# EasyEDA Pro project 鲲FOC无刷电机控制器.epro, board 磁编码器板
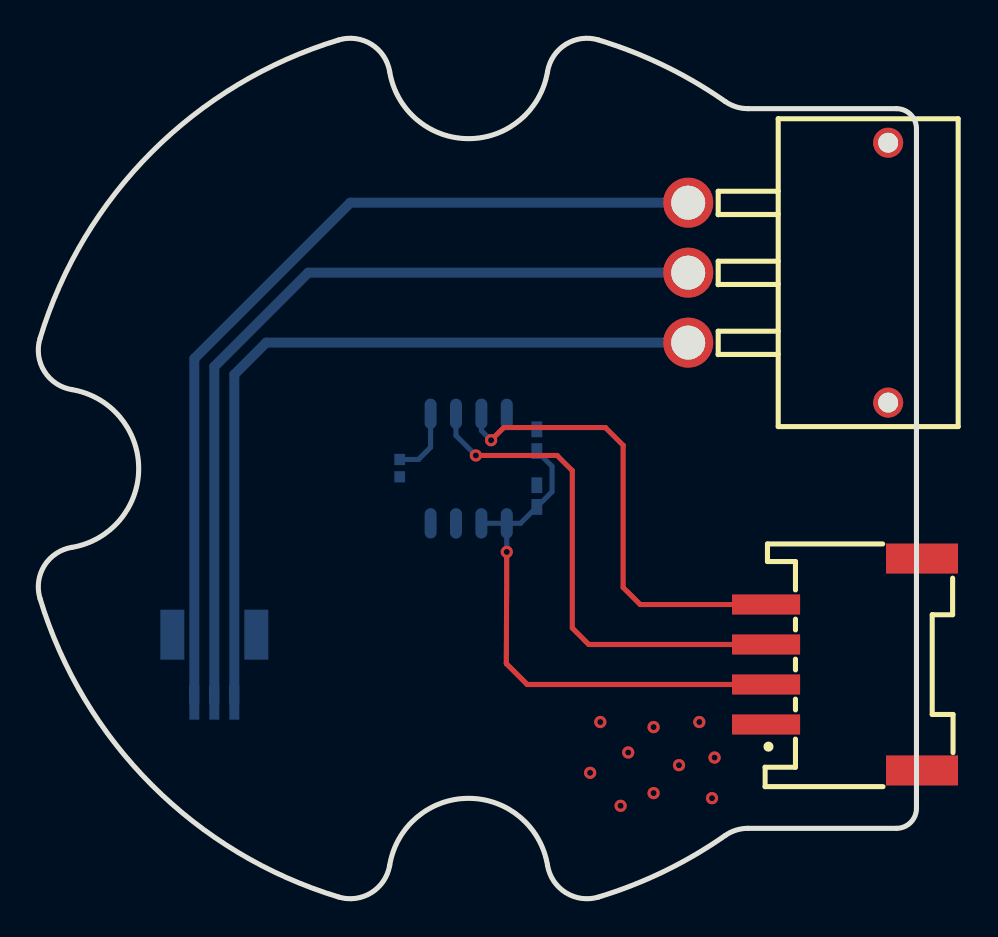
[diagram p4: board, top side]
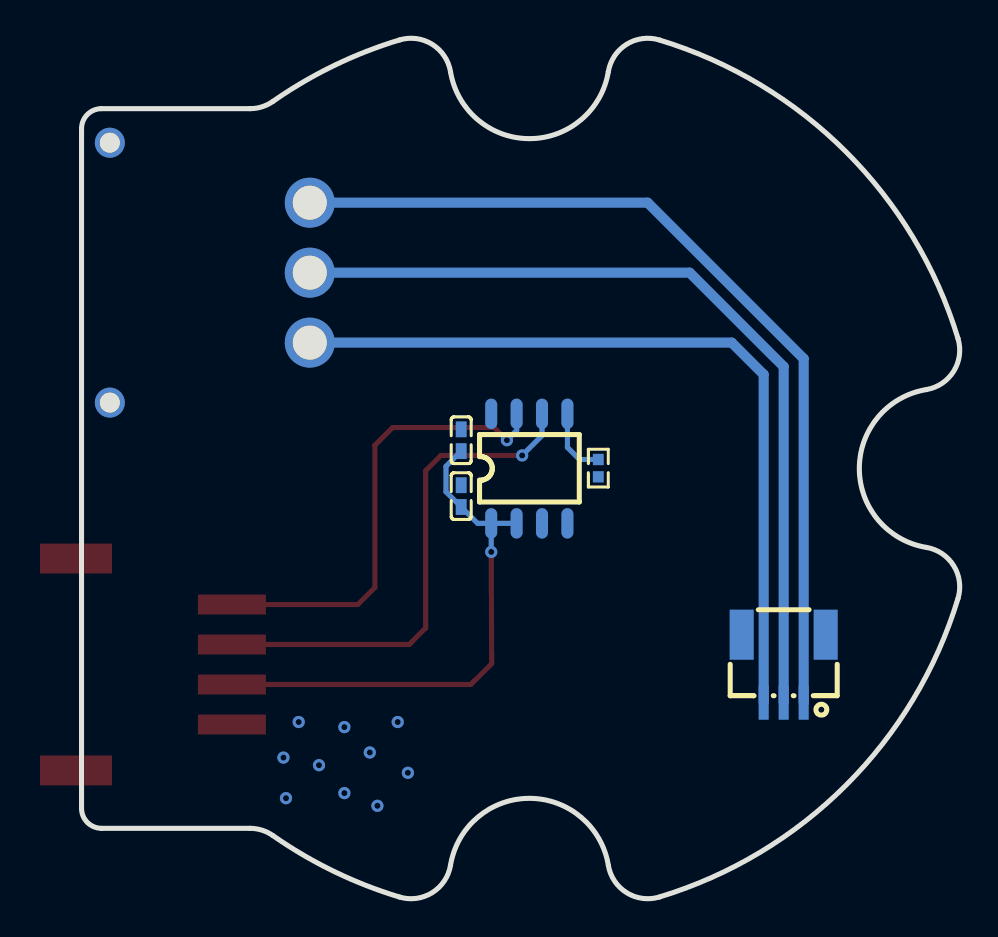
[diagram p5: board, bottom side, seen from below]

Outline 43.92 x 43.04 mm; copper layers: Top Layer, Bottom Layer. Coordinates in mm from the lower left corner of the outline.
Outline path: 0.09,28.02 arc(5.68,37.36) 15.02,42.96 arc(16.66,42.74) 17.58,41.37 arc(21.52,38.02) 25.47,41.37 arc(26.39,42.74) 28.02,42.96 arc(31.31,41.67) 34.35,39.88 arc(34.9,39.61) 35.5,39.52 42.92,39.52 arc(43.63,39.23) 43.92,38.52 43.92,4.52 arc(43.63,3.82) 42.92,3.52 35.5,3.52 arc(34.9,3.43) 34.35,3.16 arc(31.31,1.37) 28.02,0.09 arc(26.39,0.3) 25.47,1.67 arc(21.52,5.02) 17.58,1.67 arc(16.66,0.3) 15.02,0.09 arc(5.68,5.68) 0.09,15.02 arc(0.3,16.66) 1.67,17.58 arc(5.02,21.52) 1.67,25.47 arc(0.3,26.39) 0.09,28.02
Stack: Top Layer 0.035mm / Dielectric1 1.51mm FR4 er 4.5 / Bottom Layer 0.035mm

## Design rules (mm)
spacing Default (default): track to track 0.152, other pairs 0 to 0.152
track width Default (default): min 0.254, default 0.254, max 25.4
differential pair differentialPair (default): width min 0.127, default 0.254, max 2.54; gap min 0.152, default 0.152
via Default (default): diameter min 0.61, default 0.61, max 100.025; hole min 0.305, default 0.305, max 59.995
net GND uses gge3762
pour e15 uses gge3741
pour e88 uses gge3762

## Placement (name value [footprint] x y rotation side)
C27  0.1uF  [C0402_NEW]  24.93 22.94 270 bottom
C28  1uF  [C0402_NEW]  24.93 20.14 270 bottom
CN3  连接器SH卧贴 1.0MM 间距 3P  [CONN-SMD_3P-P1.00_WAFER-SH1.0-3PWB]  8.8 11.51 0 bottom
CN4  HY2.0-4P-WT  [CONN-SMD_HY2.0-4P]  40.3 11.72 90 top
R7  1K  [R0402]  18.08 21.54 90 bottom
U6  AS5600-ASOM  [SOIC-8_L5.0-W4.0-P1.27-LS6.0-BL]  21.53 21.52 180 bottom
U7  MR30PW-M/(黄)/弯脚  [CONN-TH_MR30PW-M]  37.51 31.32 90 top

## Footprints (pads in the part's own frame, mm; a bottom-side part is the same pattern mirrored in y, then rotated)
C0402_NEW
  rect 0.79x0.54 smd: 1(-0.545,0) 2(0.545,0)
CONN-SMD_3P-P1.00_WAFER-SH1.0-3PWB
  rect 0.5x1.7 smd: 1(-1,1.7) 2(0,1.7) 3(1,1.7)
  rect 1.2x2.5 smd: 4(-2.1,-1.7) 5(2.1,-1.7)
CONN-SMD_HY2.0-4P
  rect 1x3.4 smd: 1(-3,3.9) 2(-1,3.9) 3(1,3.9) 4(3,3.9)
  rect 1.5x3.6 smd: 5(5.3,-3.9) 6(-5.3,-3.9)
CONN-TH_MR30PW-M
  round 2.5 hole 1.7: 1(3.5,5) 2(0,5) 3(-3.5,5)
  round 1.5 hole 1: 4(6.5,-5) 5(-6.5,-5)
R0402
  rect 0.566x0.54 smd: 1(-0.433,0) 2(0.433,0)
SOIC-8_L5.0-W4.0-P1.27-LS6.0-BL
  oval 0.6x1.52 smd: 1(-1.905,-2.74) 2(-0.635,-2.74) 3(0.635,-2.74) 4(1.905,-2.74) 5(1.905,2.74) 6(0.635,2.74) 7(-0.635,2.74) 8(-1.905,2.74)

## Nets
+3.3V: C27.2 C28.2 CN4.2 U6.1 U6.2
GND: C27.1 C28.1 CN4.1 R7.1 U6.4 U6.8
CN1_5: CN4.5
CN1_6: CN4.6
CN2_4: CN3.4
CN2_5: CN3.5
R6_2: R7.2 U6.5
SCL: CN4.4 U6.7
SDA: CN4.3 U6.6
U: CN3.1 U7.1
U1_4: U7.4
U1_5: U7.5
V: CN3.2 U7.2
W: CN3.3 U7.3

Pads without a net: U6 3

## Via types
v1: diameter 0.61, hole 0.305, Top Layer to Bottom Layer, 13 vias

## Routing (per net, layer and track width the routed paths; a pad name or vN(x,y) marks a point on that pad's centre or on a via; arc(x,y) is an arc through that point)
+3.3V: length 27
  Top Layer w0.254: v1(23.44,17.35) 23.41,11.76 24.46,10.72 36.41,10.72
  Bottom Layer w0.254: U6.1 v1(23.44,17.35) ; U6.1 24.12,18.78 C28.2 25.7,20.36 25.7,21.63 C27.2 ; U6.1 U6.2
GND:
  vias: v1(27.6,6.3) v1(28.11,8.84) v1(29.12,4.65) v1(29.51,7.32) v1(30.78,8.59) v1(30.78,5.28) v1(32.05,6.68) v1(33.06,8.84) v1(33.7,5.03) v1(33.82,7.06)
R6_2: length 3.5
  Bottom Layer w0.254: U6.5 19.62,22.58 19.02,21.97 R7.2
SCL: length 23.4
  Top Layer w0.254: CN4.4 30.1,14.72 29.25,15.57 29.25,22.68 28.36,23.57 23.28,23.57 v1(22.65,22.94)
  Bottom Layer w0.254: v1(22.65,22.94) 22.17,23.43 U6.7
SDA: length 25.5
  Top Layer w0.254: CN4.3 27.53,12.72 26.71,13.54 26.71,21.41 25.95,22.18 v1(21.89,22.18)
  Bottom Layer w0.254: v1(21.89,22.18) 20.89,23.17 U6.6
U: length 45.1
  Bottom Layer w0.5: 32.51,34.82 15.61,34.82 7.8,27.02 CN3.1
V: length 42.5
  Bottom Layer w0.5: CN3.2 8.81,26.62 13.51,31.32 32.51,31.32
W: length 39.8
  Bottom Layer w0.5: 9.81,9.81 9.81,26.23 11.4,27.82 32.51,27.82

## Copper pours and planes (outline as drawn; the poured copper is in the pictures)
GND on Top Layer: -8.47,48.85 -8.47,3.38 2.07,-7.16 52.37,-7.16 56.81,-2.72 56.81,40.21 47.79,49.23
GND on Bottom Layer: -8.59,46.94 -8.59,2.49 1.31,-7.42 44.75,-7.42 52.37,0.2 52.37,38.43 44.75,46.05 44.75,46.94 37.51,54.18
